# Altium schematic sheet 11_FPGA_power.SchDoc: FPGA power
size A3; Organization: Lime Microsystems; Address1: Surrey Tech Centre; Address2: Guildford GU2 7YG; Address3: Surrey; Address4: United Kingdom; Revision: v1.2; SheetNumber: 11; SheetTotal: 16
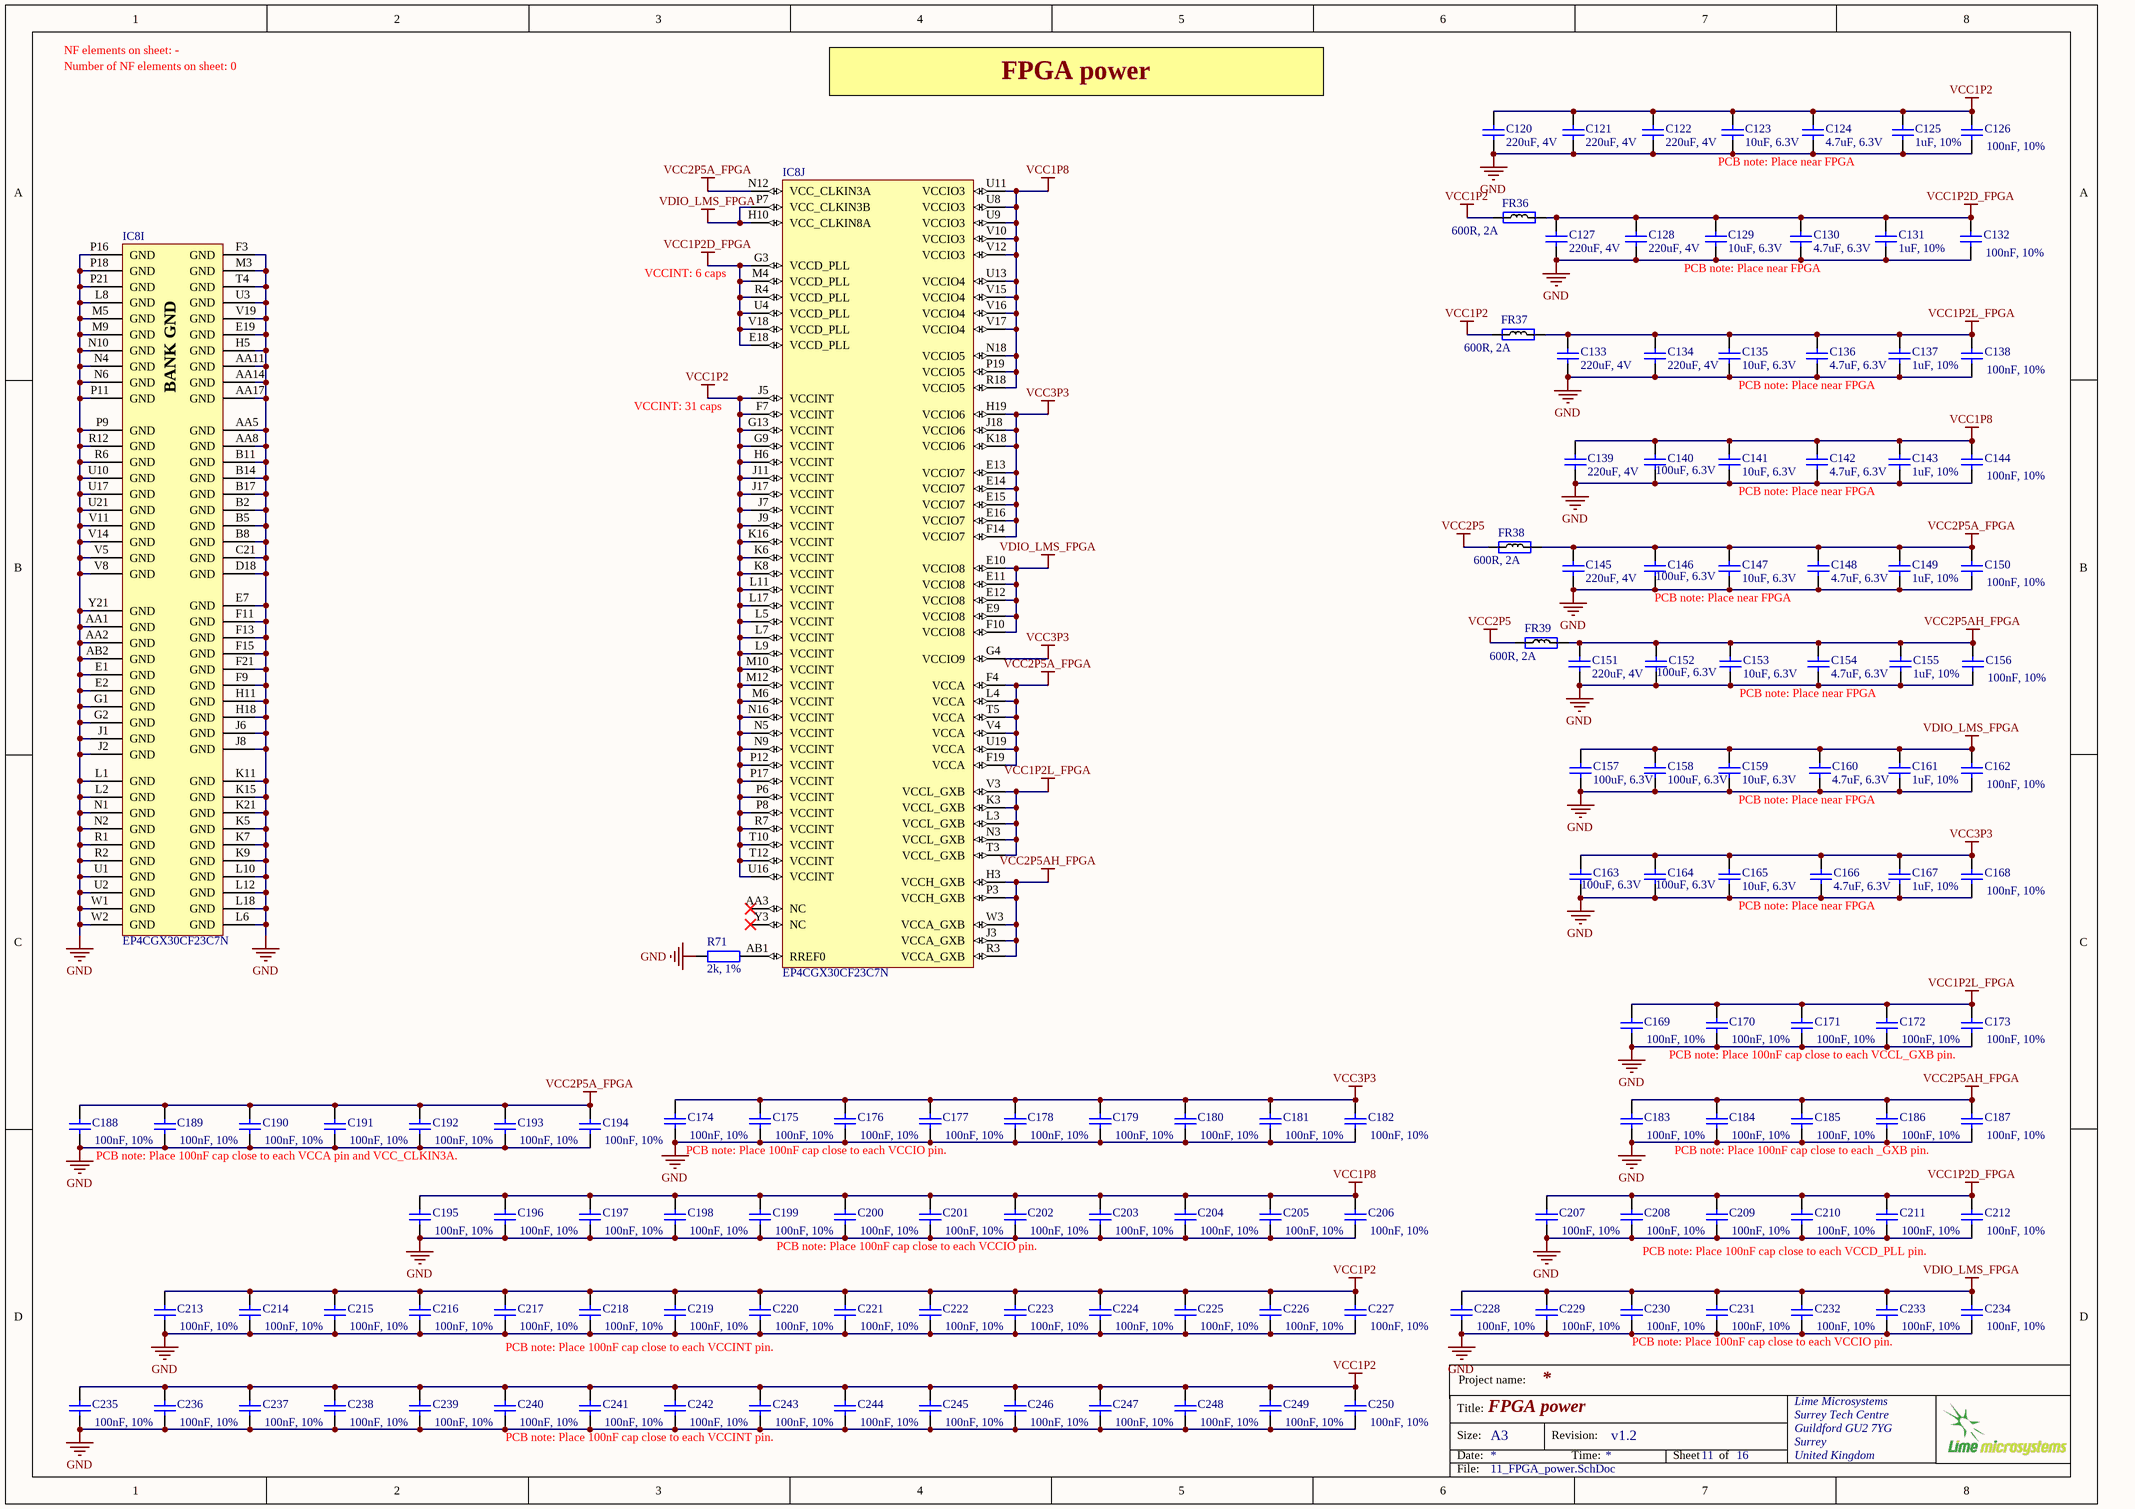
[diagram p0: 11_FPGA_power.SchDoc]

## Parts
C120  220uF, 4V  [CAP1206]
C121  220uF, 4V  [CAP1206]
C122  220uF, 4V  [CAP1206]
C123  10uF, 6.3V  [CAP0603]
C124  4.7uF, 6.3V  [CAP0402]
C125  1uF, 10%  [CAP0402]
C126  100nF, 10%  [CAP0402]
C127  220uF, 4V  [CAP1206]
C128  220uF, 4V  [CAP1206]
C129  10uF, 6.3V  [CAP0603]
C130  4.7uF, 6.3V  [CAP0402]
C131  1uF, 10%  [CAP0402]
C132  100nF, 10%  [CAP0402]
C133  220uF, 4V  [CAP1206]
C134  220uF, 4V  [CAP1206]
C135  10uF, 6.3V  [CAP0603]
C136  4.7uF, 6.3V  [CAP0402]
C137  1uF, 10%  [CAP0402]
C138  100nF, 10%  [CAP0402]
C139  220uF, 4V  [CAP1206]
C140  100uF, 6.3V  [CAP1206]
C141  10uF, 6.3V  [CAP0603]
C142  4.7uF, 6.3V  [CAP0402]
C143  1uF, 10%  [CAP0402]
C144  100nF, 10%  [CAP0402]
C145  220uF, 4V  [CAP1206]
C146  100uF, 6.3V  [CAP1206]
C147  10uF, 6.3V  [CAP0603]
C148  4.7uF, 6.3V  [CAP0402]
C149  1uF, 10%  [CAP0402]
C150  100nF, 10%  [CAP0402]
C151  220uF, 4V  [CAP1206]
C152  100uF, 6.3V  [CAP1206]
C153  10uF, 6.3V  [CAP0603]
C154  4.7uF, 6.3V  [CAP0402]
C155  1uF, 10%  [CAP0402]
C156  100nF, 10%  [CAP0402]
C157  100uF, 6.3V  [CAP1206]
C158  100uF, 6.3V  [CAP1206]
C159  10uF, 6.3V  [CAP0603]
C160  4.7uF, 6.3V  [CAP0402]
C161  1uF, 10%  [CAP0402]
C162  100nF, 10%  [CAP0402]
C163  100uF, 6.3V  [CAP1206]
C164  100uF, 6.3V  [CAP1206]
C165  10uF, 6.3V  [CAP0603]
C166  4.7uF, 6.3V  [CAP0402]
C167  1uF, 10%  [CAP0402]
C168  100nF, 10%  [CAP0402]
C169  100nF, 10%  [CAP0402]
C170  100nF, 10%  [CAP0402]
C171  100nF, 10%  [CAP0402]
C172  100nF, 10%  [CAP0402]
C173  100nF, 10%  [CAP0402]
C174  100nF, 10%  [CAP0402]
C175  100nF, 10%  [CAP0402]
C176  100nF, 10%  [CAP0402]
C177  100nF, 10%  [CAP0402]
C178  100nF, 10%  [CAP0402]
C179  100nF, 10%  [CAP0402]
C180  100nF, 10%  [CAP0402]
C181  100nF, 10%  [CAP0402]
C182  100nF, 10%  [CAP0402]
C183  100nF, 10%  [CAP0402]
C184  100nF, 10%  [CAP0402]
C185  100nF, 10%  [CAP0402]
C186  100nF, 10%  [CAP0402]
C187  100nF, 10%  [CAP0402]
C188  100nF, 10%  [CAP0402]
C189  100nF, 10%  [CAP0402]
C190  100nF, 10%  [CAP0402]
C191  100nF, 10%  [CAP0402]
C192  100nF, 10%  [CAP0402]
C193  100nF, 10%  [CAP0402]
C194  100nF, 10%  [CAP0402]
C195  100nF, 10%  [CAP0402]
C196  100nF, 10%  [CAP0402]
C197  100nF, 10%  [CAP0402]
C198  100nF, 10%  [CAP0402]
C199  100nF, 10%  [CAP0402]
C200  100nF, 10%  [CAP0402]
C201  100nF, 10%  [CAP0402]
C202  100nF, 10%  [CAP0402]
C203  100nF, 10%  [CAP0402]
C204  100nF, 10%  [CAP0402]
C205  100nF, 10%  [CAP0402]
C206  100nF, 10%  [CAP0402]
C207  100nF, 10%  [CAP0402]
C208  100nF, 10%  [CAP0402]
C209  100nF, 10%  [CAP0402]
C210  100nF, 10%  [CAP0402]
C211  100nF, 10%  [CAP0402]
C212  100nF, 10%  [CAP0402]
C213  100nF, 10%  [CAP0402]
C214  100nF, 10%  [CAP0402]
C215  100nF, 10%  [CAP0402]
C216  100nF, 10%  [CAP0402]
C217  100nF, 10%  [CAP0402]
C218  100nF, 10%  [CAP0402]
C219  100nF, 10%  [CAP0402]
C220  100nF, 10%  [CAP0402]
C221  100nF, 10%  [CAP0402]
C222  100nF, 10%  [CAP0402]
C223  100nF, 10%  [CAP0402]
C224  100nF, 10%  [CAP0402]
C225  100nF, 10%  [CAP0402]
C226  100nF, 10%  [CAP0402]
C227  100nF, 10%  [CAP0402]
C228  100nF, 10%  [CAP0402]
C229  100nF, 10%  [CAP0402]
C230  100nF, 10%  [CAP0402]
C231  100nF, 10%  [CAP0402]
C232  100nF, 10%  [CAP0402]
C233  100nF, 10%  [CAP0402]
C234  100nF, 10%  [CAP0402]
C235  100nF, 10%  [CAP0402]
C236  100nF, 10%  [CAP0402]
C237  100nF, 10%  [CAP0402]
C238  100nF, 10%  [CAP0402]
C239  100nF, 10%  [CAP0402]
C240  100nF, 10%  [CAP0402]
C241  100nF, 10%  [CAP0402]
C242  100nF, 10%  [CAP0402]
C243  100nF, 10%  [CAP0402]
C244  100nF, 10%  [CAP0402]
C245  100nF, 10%  [CAP0402]
C246  100nF, 10%  [CAP0402]
C247  100nF, 10%  [CAP0402]
C248  100nF, 10%  [CAP0402]
C249  100nF, 10%  [CAP0402]
C250  100nF, 10%  [CAP0402]
FR36  600R, 2A  [RES0805]
FR37  600R, 2A  [RES0805]
FR38  600R, 2A  [RES0805]
FR39  600R, 2A  [RES0805]
IC8  EP4CGX30CF23C7N  [ALTR-FBGA484_A-200]  (parts I,J of 10)
R71  2k, 1%  [RES0402]

## Nets
GND: C120.1 C121.1 C122.1 C123.1 C124.1 C125.2 C126.2 C127.1 C128.1 C129.1 C130.1 C131.2 C132.2 C133.1 C134.1 C135.1 C136.1 C137.1 C138.2 C139.1 C140.1 C141.1 C142.1 C143.1 C144.2 C145.1 C146.1 C147.1 C148.1 C149.1 C150.2 C151.1 C152.1 C153.1 C154.1 C155.1 C156.2 C157.1 C158.1 C159.1 C160.1 C161.1 C162.2 C163.1 C164.1 C165.1 C166.1 C167.1 C168.2 C169.2 C170.2 C171.2 C172.2 C173.2 C174.2 C175.2 C176.2 C177.2 C178.2 C179.2 C180.2 C181.2 C182.2 C183.2 C184.2 C185.2 C186.2 C187.2 C188.2 C189.2 C190.2 C191.2 C192.2 C193.2 C194.2 C195.2 C196.2 C197.2 C198.2 C199.2 C200.2 C201.2 C202.2 C203.2 C204.2 C205.2 C206.2 C207.2 C208.2 C209.2 C210.2 C211.2 C212.2 C213.2 C214.2 C215.2 C216.2 C217.2 C218.2 C219.2 C220.2 C221.2 C222.2 C223.2 C224.2 C225.2 C226.2 C227.2 C228.2 C229.2 C230.2 C231.2 C232.2 C233.2 C234.2 C235.2 C236.2 C237.2 C238.2 C239.2 C240.2 C241.2 C242.2 C243.2 C244.2 C245.2 C246.2 C247.2 C248.2 C249.2 C250.2 IC8.AA1(GND) IC8.AA2(GND) IC8.AA5(GND) IC8.AA8(GND) IC8.AA11(GND) IC8.AA14(GND) IC8.AA17(GND) IC8.AB2(GND) IC8.B2(GND) IC8.B5(GND) IC8.B8(GND) IC8.B11(GND) IC8.B14(GND) IC8.B17(GND) IC8.C21(GND) IC8.D18(GND) IC8.E1(GND) IC8.E2(GND) IC8.E7(GND) IC8.E19(GND) IC8.F3(GND) IC8.F9(GND) IC8.F11(GND) IC8.F13(GND) IC8.F15(GND) IC8.F21(GND) IC8.G1(GND) IC8.G2(GND) IC8.H5(GND) IC8.H11(GND) IC8.H18(GND) IC8.J1(GND) IC8.J2(GND) IC8.J6(GND) IC8.J8(GND) IC8.K5(GND) IC8.K7(GND) IC8.K9(GND) IC8.K11(GND) IC8.K15(GND) IC8.K21(GND) IC8.L1(GND) IC8.L2(GND) IC8.L6(GND) IC8.L8(GND) IC8.L10(GND) IC8.L12(GND) IC8.L18(GND) IC8.M3(GND) IC8.M5(GND) IC8.M9(GND) IC8.N1(GND) IC8.N2(GND) IC8.N4(GND) IC8.N6(GND) IC8.N10(GND) IC8.P9(GND) IC8.P11(GND) IC8.P16(GND) IC8.P18(GND) IC8.P21(GND) IC8.R1(GND) IC8.R2(GND) IC8.R6(GND) IC8.R12(GND) IC8.T4(GND) IC8.U1(GND) IC8.U2(GND) IC8.U3(GND) IC8.U10(GND) IC8.U17(GND) IC8.U21(GND) IC8.V5(GND) IC8.V8(GND) IC8.V11(GND) IC8.V14(GND) IC8.V19(GND) IC8.W1(GND) IC8.W2(GND) IC8.Y21(GND) R71.2
VCC1P2: C120.2 C121.2 C122.2 C123.2 C124.2 C125.1 C126.1 C213.1 C214.1 C215.1 C216.1 C217.1 C218.1 C219.1 C220.1 C221.1 C222.1 C223.1 C224.1 C225.1 C226.1 C227.1 C235.1 C236.1 C237.1 C238.1 C239.1 C240.1 C241.1 C242.1 C243.1 C244.1 C245.1 C246.1 C247.1 C248.1 C249.1 C250.1 FR36.1 FR37.1 IC8.F7(VCCINT) IC8.G9(VCCINT) IC8.G13(VCCINT) IC8.H6(VCCINT) IC8.J5(VCCINT) IC8.J7(VCCINT) IC8.J9(VCCINT) IC8.J11(VCCINT) IC8.J17(VCCINT) IC8.K6(VCCINT) IC8.K8(VCCINT) IC8.K16(VCCINT) IC8.L5(VCCINT) IC8.L7(VCCINT) IC8.L9(VCCINT) IC8.L11(VCCINT) IC8.L17(VCCINT) IC8.M6(VCCINT) IC8.M10(VCCINT) IC8.M12(VCCINT) IC8.N5(VCCINT) IC8.N9(VCCINT) IC8.N16(VCCINT) IC8.P6(VCCINT) IC8.P8(VCCINT) IC8.P12(VCCINT) IC8.P17(VCCINT) IC8.R7(VCCINT) IC8.T10(VCCINT) IC8.T12(VCCINT) IC8.U16(VCCINT)
VCC1P2D_FPGA: C127.2 C128.2 C129.2 C130.2 C131.1 C132.1 C207.1 C208.1 C209.1 C210.1 C211.1 C212.1 FR36.2 IC8.E18(VCCD_PLL) IC8.G3(VCCD_PLL) IC8.M4(VCCD_PLL) IC8.R4(VCCD_PLL) IC8.U4(VCCD_PLL) IC8.V18(VCCD_PLL)
VCC1P2L_FPGA: C133.2 C134.2 C135.2 C136.2 C137.2 C138.1 C169.1 C170.1 C171.1 C172.1 C173.1 FR37.2 IC8.K3(VCCL_GXB) IC8.L3(VCCL_GXB) IC8.N3(VCCL_GXB) IC8.T3(VCCL_GXB) IC8.V3(VCCL_GXB)
VCC1P8: C139.2 C140.2 C141.2 C142.2 C143.2 C144.1 C195.1 C196.1 C197.1 C198.1 C199.1 C200.1 C201.1 C202.1 C203.1 C204.1 C205.1 C206.1 IC8.N18(VCCIO5) IC8.P19(VCCIO5) IC8.R18(VCCIO5) IC8.U8(VCCIO3) IC8.U9(VCCIO3) IC8.U11(VCCIO3) IC8.U13(VCCIO4) IC8.V10(VCCIO3) IC8.V12(VCCIO3) IC8.V15(VCCIO4) IC8.V16(VCCIO4) IC8.V17(VCCIO4)
VCC2P5: FR38.1 FR39.1
VCC2P5A_FPGA: C145.2 C146.2 C147.2 C148.2 C149.2 C150.1 C188.1 C189.1 C190.1 C191.1 C192.1 C193.1 C194.1 FR38.2 IC8.F4(VCCA) IC8.F19(VCCA) IC8.L4(VCCA) IC8.N12(VCC_CLKIN3A) IC8.T5(VCCA) IC8.U19(VCCA) IC8.V4(VCCA)
VCC2P5AH_FPGA: C151.2 C152.2 C153.2 C154.2 C155.2 C156.1 C183.1 C184.1 C185.1 C186.1 C187.1 FR39.2 IC8.H3(VCCH_GXB) IC8.J3(VCCA_GXB) IC8.P3(VCCH_GXB) IC8.R3(VCCA_GXB) IC8.W3(VCCA_GXB)
VCC3P3: C163.2 C164.2 C165.2 C166.2 C167.2 C168.1 C174.1 C175.1 C176.1 C177.1 C178.1 C179.1 C180.1 C181.1 C182.1 IC8.E13(VCCIO7) IC8.E14(VCCIO7) IC8.E15(VCCIO7) IC8.E16(VCCIO7) IC8.F14(VCCIO7) IC8.G4(VCCIO9) IC8.H19(VCCIO6) IC8.J18(VCCIO6) IC8.K18(VCCIO6)
VDIO_LMS_FPGA: C157.2 C158.2 C159.2 C160.2 C161.2 C162.1 C228.1 C229.1 C230.1 C231.1 C232.1 C233.1 C234.1 IC8.E9(VCCIO8) IC8.E10(VCCIO8) IC8.E11(VCCIO8) IC8.E12(VCCIO8) IC8.F10(VCCIO8) IC8.H10(VCC_CLKIN8A) IC8.P7(VCC_CLKIN3B)
NetIC8_AB1: IC8.AB1(RREF0) R71.1

Not connected (* = marked no-connect by the designer): IC8 AA3(NC)* Y3(NC)*

## Notes on the sheet
- NF elements on sheet: -
- Number of NF elements on sheet: 0
- FPGA power
- PCB note: Place near FPGA
- (near IC8) VCCINT: 6 caps
- VCCINT: 31 caps
- PCB note: Place 100nF cap close to each VCCL_GXB pin.
- PCB note: Place 100nF cap close to each VCCA pin and VCC_CLKIN3A.
- PCB note: Place 100nF cap close to each VCCIO pin.
- PCB note: Place 100nF cap close to each _GXB pin.
- PCB note: Place 100nF cap close to each VCCD_PLL pin.
- PCB note: Place 100nF cap close to each VCCINT pin.
- Project name:
- Title:
- Size:
- Date:
- A3
- Revision:
- Time:
- Sheet
- of
- File:
- (in symbol EP4CGX30CF23C7N, part I) BANK GND

## Library data of the parts
C120-C122 C127 C128 C133 C134 C139 C145 C151 = Cap_1206: Manufacturer Part Number: GRM31CR60G227ME11L; Manufacturer: Murata Electronics North America; Part Description: 220µF ±20% 4V X5R Ceramic Capacitor -55°C ~ 85°C Surface Mount, MLCC 1206 (3216 Metric) 0.126" L x 0.063" W (3.20mm x 1.60mm); Capacitance: 220µF; Temperature Coefficient: X5R; Tolerance: ±20%; Package / Case: 1206 (3216 Metric); Supplier 1: Digi-Key; Packaging: Cut Tape (CT); Size / Dimension: 0.126" L x 0.063" W (3.20mm x 1.60mm); Operating Temperature: -55°C ~ 85°C; Voltage - Rated: 4V; Mounting Type: Surface Mount, MLCC; Ratings: -; Supplier Part Number 1: 490-9774-1-ND; Category: Capacitors; Lead Spacing: -; Lead Style: -; Applications: General Purpose; Features: -; Height - Seated (Max): -; Thickness (Max): 0.075" (1.90mm); RoHS: RoHS Compliant; Value: 220uF, 4V
C123 C129 C135 C141 C147 C153 C159 C165 = Cap_0603: Manufacturer Part Number 1: CC0603MRX5R5BB106; Part Description: 10µF ±20% 6.3V X5R Ceramic Capacitor -55°C ~ 85°C Surface Mount, MLCC 0603 (1608 Metric) 0.063" L x 0.031" W (1.60mm x 0.80mm); Manufacturer: Yageo; Capacitance: 10µF; Tolerance: ±20%; Supplier 1: Digi-Key; Supplier Part Number 1: 311-1448-2-ND; Package / Case: 0603 (1608 Metric); Category: Capacitors; Voltage - Rated: 6.3V; Value: 10uF, 6.3V
C124 C130 C136 C142 C148 C154 C160 C166 = Cap_0402: Manufacturer Part Number 1: GRM155R60J475ME87D; Manufacturer: Murata Electronics North America; Part Description: 4.7µF ±20% 6.3V X5R Ceramic Capacitor -55°C ~ 85°C Surface Mount, MLCC 0402 (1005 Metric) 0.039" L x 0.020" W (1.00mm x 0.50mm); Temperature Coefficient: X5R; Capacitance: 4.7µF; Tolerance: ±20%; Value: 4.7uF, 6.3V; Supplier 1: Digi-Key; Supplier Part Number 1: 490-5408-1-ND; Category: Capacitors; Voltage - Rated: 6.3V; Thickness (Max): 0.022" (0.55mm); Applications: General Purpose; Package / Case: 0402 (1005 Metric); Size / Dimension: 0.039" L x 0.020" W (1.00mm x 0.50mm); Features: Derating Recommended; Mounting Type: Surface Mount, MLCC; Ratings: -; Lead Style: -; Operating Temperature: -55°C ~ 85°C; Lead Spacing: -; RoHS: RoHS Compliant; Height - Seated (Max): -; Packaging: Cut Tape (CT)
C125 C131 C137 C143 C149 C155 C161 C167 = Cap_0402: Manufacturer Part Number 1: GRM155R61A105KE15J; Manufacturer: TDK; Part Description: 1µF ±10% 10V X5R Ceramic Capacitor -55°C ~ 85°C Surface Mount, MLCC 0402 (1005 Metric) 0.039" L x 0.020" W (1.00mm x 0.50mm); Voltage Rating: 10; Product Range: TDK - C Series; Ceramic Capacitor Case: 0402 [1005 Metric]; Capacitance: 1; Dielectric Characteristic: X6; Value: 1uF, 10%; Supplier 1: Newark; Supplier Part Number 1: 490-6298-2-ND; Capacitance Tolerance: ± 10%; MSL: -; RoHS: YES
C126 C132 C138 C144 C150 C156 C162 C168-C250 = Cap_0603: Manufacturer Part Number 1: GRM155R71C104KA88D; Part Description: 0.10µF ±10% 16V X7R Ceramic Capacitor -55°C ~ 125°C Surface Mount, MLCC 0402 (1005 Metric) 0.039" L x 0.020" W (1.00mm x 0.50mm); Brand: Murata Electronics; Type: General Purpose MLCC; Capacitance: 0.1 uF; Temperature Coefficient / Code: +/- 15 %; Voltage Rating DC: 16 V; Supplier 1: Mouser; Supplier Part Number 1: 81-GRM155R71C104KA88; Tolerance: 10 %; Case Code - in: 0402; Manufacturer: Murata Electronics; Category: Multilayer Ceramic Capacitors MLCC - SMD/SMT; Value: 100nF, 10%; Manufacturer Part Number: GRM155R71C104KA88D; Maximum Operating Temperature: + 125 C; Minimum Operating Temperature: - 55 C; Minimum Order Quantity: 1; Operating Temperature Range: - 55 C to + 125 C; Package / Case: 0402 (1005 metric); Packaging: Reel; Product: General Type MLCCs; Product Category: Low & Medium Capacitance SMD Ceramic Chip Capacitors; Reeling: True; RoHS - Mouser: Y; RoHS: RoHS Compliant; Series: GRM; Standard Pack Qty: 10000; Termination Style: SMD/SMT
C140 C146 C152 C157 C158 C163 C164 = Cap_1206: Manufacturer: MURATA; Manufacturer Part Number 1: GRM31CR60J107ME39L.; Part Description: SMD Multilayer Ceramic Capacitor, GRM Series, 100 µF, ± 20%, X5R, 6.3 V, 1206 [3216 Metric]; Capacitance Tolerance: ± 20%; Ceramic Capacitor Case: 1206 [3216 Metric]; Voltage Rating: 6.3; value: 100uF, 6.3V; Supplier Part Number 1: 1735535; Supplier 1: Farnell
FR36-FR39 = Ferrite: Manufacturer Part Number 1: MPZ2012S601AT000; Manufacturer: TDK Corporation; Part Description: FERRITE BEAD 600 OHM 0805 1LN; Filter Type: Differential Mode - Single; Impedance @ Frequency: 600 Ohm @ 100MHz; DC Resistance (DCR): 100 mOhm Max; Supplier 1: Digi-Key; Supplier Part Number 1: 445-2206-2-ND; Mounting Type: Surface Mount; RoHS: RoHS Compliant; Height (Max): 0.041" (1.05mm); Packaging: Tape & Reel (TR); Category: Filters; Current Rating: 2A; Package / Case: 0805 (2012 Metric); Size / Dimension: 0.079" L x 0.049" W (2.00mm x 1.25mm)
IC8 = EP4CGX30CF23C7N: Manufacturer: Altera; Part Description: IC FPGA 290 I/O 484FBGA; Voltage - Supply: 1.16 V ~ 1.24 V; Number of I/O: 290; Total RAM Bits: 1105920; Number of Logic Elements/Cells: 29440; Number of LABs/CLBs: 1840; Supplier 1: Digi-Key; Package / Case: 484-BGA; Operating Temperature: 0°C ~ 85°C; Mounting Type: Surface Mount; Number of Gates: -; Supplier Device Package: 484-FBGA (23x23); Category: Integrated Circuits (ICs); RoHS: RoHS Compliant; Supplier Part Number 1: 544-2730-ND; Manufacturer Part Number 1: EP4CGX30CF23C7N
R71 = Res_0402: Manufacturer: Yageo; Manufacturer Part Number: RC0402FR-072KL; Part Description: RES SMD 2K OHM 1% 1/16W 0402; Power (Watts): 0.063W, 1/16W; Temperature Coefficient: ±100ppm/°C; Packaging: Cut Tape (CT); Size / Dimension: 0.039" L x 0.020" W (1.00mm x 0.50mm); Operating Temperature: -55°C ~ 155°C; Resistance (Ohms): 2k; Number of Terminations: 2; Supplier Device Package: 0402; Tolerance: ±1%; Features: Moisture Resistant; Category: Resistors; Height: 0.016" (0.40mm); Composition: Thick Film; Supplier 1: Digi-Key; Supplier Part Number 1: 311-2KLRCT-ND; Package / Case: 0402 (1005 Metric); RoHS: RoHS Compliant; Value: 2k, 1%